# EAGLE design fabftdi-tiny45 (EAGLE 8.2.2)
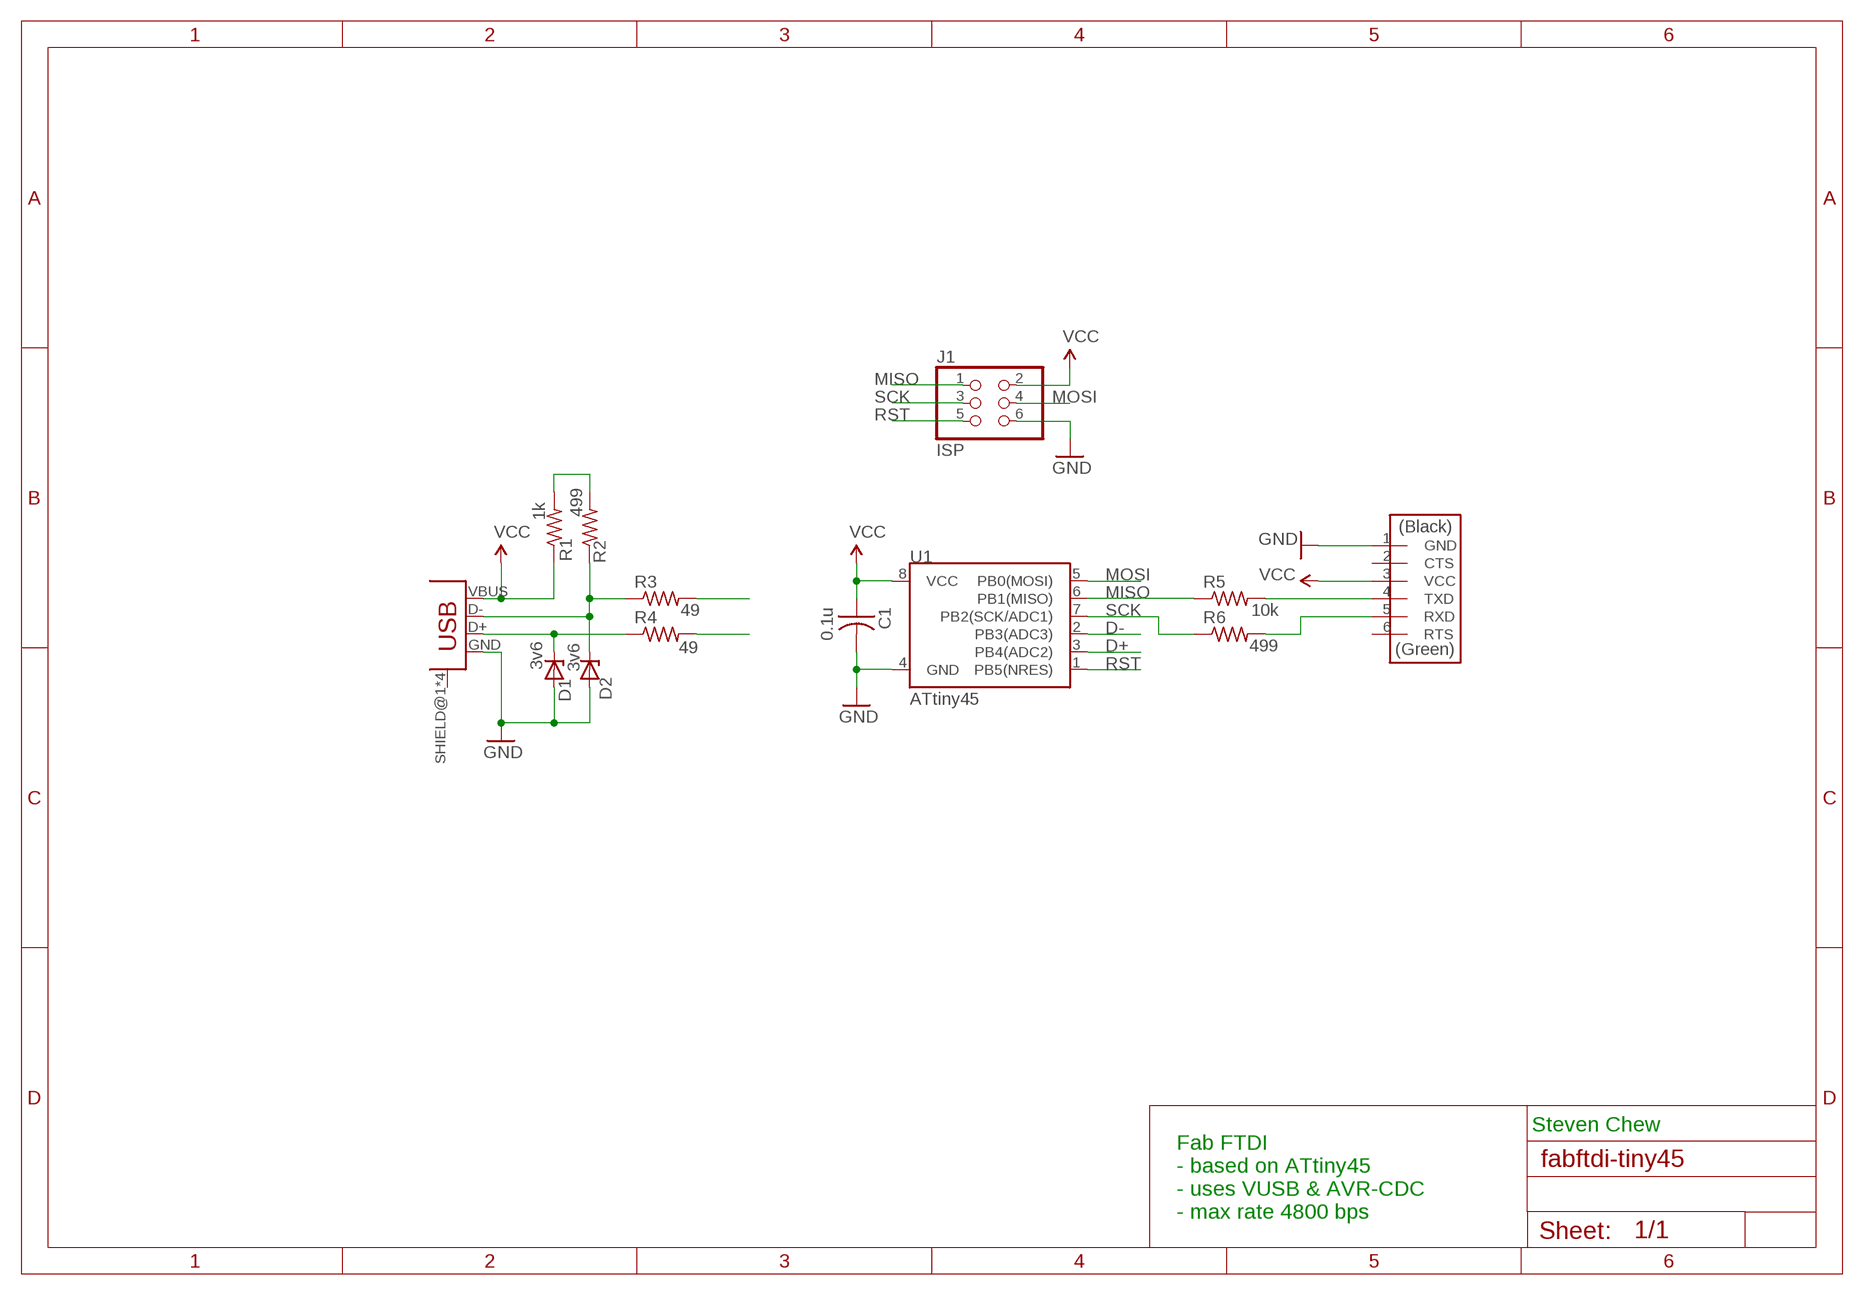
[diagram p0: schematic, sheet 1]

## Parts
C1  0.1u  CAP-US1206FAB  [C1206FAB]
D1  3v6  ZENER_DIODESOD123  [SOD123]
D2  3v6  ZENER_DIODESOD123  [SOD123]
J1  ISP  PINHD-2X3-SMD-FAB  [2X03SMD-FAB]
J2  FTDI-SMD-HEADER  [1X06SMD]
R1  1k  RES-US1206FAB  [R1206FAB]
R2  499  RES-US1206FAB  [R1206FAB]
R3  49  RES-US1206FAB  [R1206FAB]
R4  49  RES-US1206FAB  [R1206FAB]
R5  10k  RES-US1206FAB  [R1206FAB]
R6  499  RES-US1206FAB  [R1206FAB]
U1  ATtiny45  ATTINY85TINY45-20-SMT  [SO08-EIAJ]
U2  USB_MINI  [USB_MINI]

## Nets
D+: R4.2 U1.3(PB4(ADC2))
D-: R3.2 U1.2(PB3(ADC3))
GND: C1.2 D1.ANODE D2.ANODE J1.6 J2.1(GND) U1.4(GND) U2.GND
MISO: J1.1 R5.1 U1.6(PB1(MISO))
MOSI: J1.4 U1.5(PB0(MOSI))
N$1: D1.CATHODE R4.1 U2.D+
N$2: D2.CATHODE R2.1 R3.1 U2.D-
N$5: R1.2 R2.2
N$10: J2.4(TXD) R5.2
N$13: J2.5(RXD) R6.2
RST: J1.5 U1.1(PB5(NRES))
SCK: J1.3 R6.1 U1.7(PB2(SCK/ADC1))
VCC: C1.1 J1.2 J2.3(VCC) R1.1 U1.8(VCC) U2.VBUS
Unconnected: J2.2(CTS) J2.6(RTS) U2.SHIELD@1(SHIELD) U2.SHIELD@2(SHIELD) U2.SHIELD@3(SHIELD) U2.SHIELD@4(SHIELD)

## Notes on the sheet
- Steven Chew
- Fab FTDI
  - based on ATtiny45
  - uses VUSB & AVR-CDC
  - max rate 4800 bps

## Library data of the parts
C1 = 00fab:CAP-US
D1 D2 = 00fab:ZENER_DIODE: zener diode
J1 = 00fab:PINHD-2X3-SMD-FAB
J2 = 00fab:FTDI-SMD-HEADER
R1-R6 = 00fab:RES-US: Resistor (US Symbol) Variants with postfix FAB are widened to allow the routing of internal traces
U1 = 00fab:ATTINY85: Atmel 8-pin 2/4/8kB flash uC; PROD_ID: IC-08922; VALUE: Tiny45-20-SMT
U2 = 00fab:USB_MINI

## Board
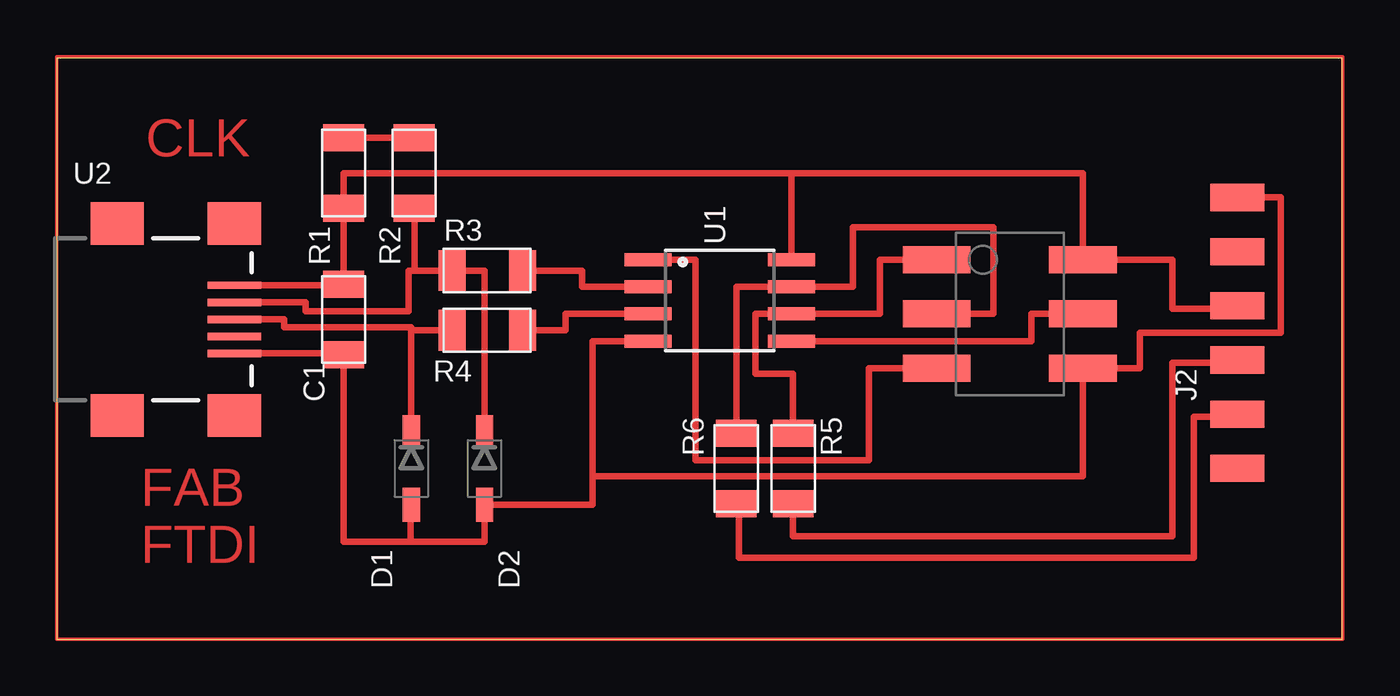
[diagram p1: board, top side]

Size 60.3 x 27.23 mm. Coordinates in mm from the lower left corner, seen from the top.
Outline: 0,0 60.3,0 60.3,27.23 0,27.23 0,0
Copper layers (1*16): Top 0.035mm / dielectric 1.5mm / Bottom 0.035mm
Design rules "default *": minimum track width 6mil, minimum drill 0.35mm, track to track 12mil, track to pad 12mil, pad to pad 12mil, via to via 6mil, smd to smd 8mil, copper to edge 40mil, drill to drill 6mil, minimum pad ring 10mil, minimum via ring 8mil, stop-mask expansion 4mil, vias tented up to drill 0mil, thermal gap 10mil

### Footprints (pad centres in the part's own frame; a part is rotated, then mirrored left to right if it is on the bottom)
C1206FAB = smd 1.27 x 1.905: 1 -1.651,0; 2 1.651,0
SOD123 = smd 1.6 x 0.8: ANODE 1.7,0; CATHODE -1.7,0
2X03SMD-FAB = smd 3.175 x 1.27: 1 -3.429,2.54; 2 3.429,2.54; 3 -3.429,0; 4 3.429,0; 5 -3.429,-2.54; 6 3.429,-2.54
1X06SMD = smd 2.54 x 1.27: 1 0,6.35; 2 0,3.81; 3 0,1.27; 4 0,-1.27; 5 0,-3.81; 6 0,-6.35
R1206FAB = smd 1.27 x 1.905: 1 -1.651,0; 2 1.651,0
SO08-EIAJ = smd 0.61 x 2.21: 1 -1.905,-3.378; 2 -0.635,-3.378; 3 0.635,-3.378; 4 1.905,-3.378; 5 1.905,3.353; 6 0.635,3.353; 7 -0.635,3.353; 8 -1.905,3.353
USB_MINI = smd 2.5 x 0.35: D+ 3.77,0; D- 3.77,0.8; GND 3.77,-1.6; ID 3.77,-0.8; VBUS 3.77,1.6 | smd 2.5 x 2: SHIELD@1 -1.73,-4.5; SHIELD@2 -1.73,4.5; SHIELD@3 3.77,4.5; SHIELD@4 3.77,-4.5

### Placement (x,y rotation side)
C1  13.46,14.99 270 top
D1  16.64,8 270 top
D2  20.07,8 270 top
J1  44.7,15.24 0 top
J2  55.37,14.35 0 top
R1  13.46,21.84 90 top
R2  16.76,21.84 90 top
R3  20.19,17.27 0 top
R4  20.19,14.48 0 top
R5  34.54,8 270 top
R6  31.88,8 270 top
U1  31.11,15.88 270 top
U2  4.57,14.99 0 top

### Tracks (layer width: path | path; a pad name or v marks a point on that pad's centre or on a via)
D+
  Top 0.305: R4.2 23.88,14.48 23.88,15.24 U1.3
D-
  Top 0.305: R3.2 24.64,17.27 24.64,16.51 U1.2
GND
  Top 0.305: U2.GND 13.46,13.39 C1.2 13.46,4.57 16.61,4.57 | 16.61,4.57 20.07,4.57 D2.ANODE 25.15,6.3 25.15,7.62 | D1.ANODE 16.61,6.3 16.61,4.57 | 25.15,7.62 25.15,13.97 U1.4 | 25.15,7.62 48.13,7.62 J1.6 50.8,12.7 50.8,14.35 57.4,14.35 57.4,20.7 J2.1
MISO
  Top 0.305: R5.1 34.54,12.45 32.77,12.45 32.77,15.24 U1.6 38.61,15.24 38.61,17.78 J1.1
MOSI
  Top 0.305: U1.5 45.72,13.97 45.72,15.24 J1.4
N$1
  Top 0.305: U2.D+ 10.67,14.99 10.67,14.61 16.64,14.61 16.64,14.48 | D1.CATHODE | 16.64,14.48 D1.CATHODE | R4.1 16.64,14.48
N$2
  Top 0.305: U2.D- 11.68,15.79 11.68,15.37 16.51,15.37 16.51,17.27 16.8,17.27 | 16.8,17.27 R3.1 20.07,17.27 D2.CATHODE | R2.1 16.8,20.19 16.8,17.27
N$3
  Top 0.152: 0,0 60.33,0 60.33,27.3 0,27.3 0,0
N$5
  Top 0.305: R1.2 R2.2
N$10
  Top 0.305: R5.2 34.54,4.83 52.32,4.83 52.32,12.95 55.37,12.95 J2.4
N$13
  Top 0.305: R6.2 32,6.35 32,3.81 53.34,3.81 53.34,10.41 55.37,10.41 J2.5
RST
  Top 0.305: U1.1 29.97,17.78 29.97,8.38 38.1,8.38 38.1,12.7 J1.5
SCK
  Top 0.305: R6.1 31.88,16.51 U1.7 37.34,16.51 37.34,19.3 43.94,19.3 43.94,15.24 J1.3
VCC
  Top 0.305: U2.VBUS 13.46,16.59 C1.1 R1.1 13.46,21.84 34.47,21.84 | 34.47,21.84 U1.8 | 34.47,21.84 48.13,21.84 J1.2 52.32,17.78 52.32,15.49 55.37,15.49 J2.3

### Text on the board
Top: CLK | FAB / FTDI